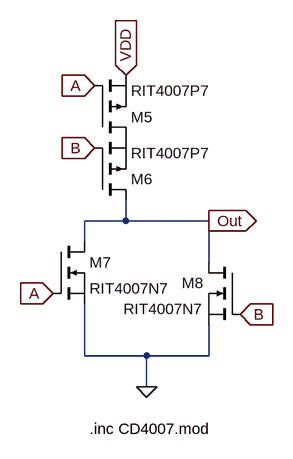
[diagram p0: schematic Gate_NOR.asc]
Gate_NOR.asc, the LTspice schematic file:
Version 4
SHEET 1 880 680
WIRE -656 -80 -656 -112
WIRE -656 -80 -720 -80
WIRE -528 -80 -656 -80
WIRE -720 -48 -720 -80
WIRE -528 -16 -528 -80
WIRE -720 128 -720 48
WIRE -624 128 -720 128
WIRE -528 128 -528 80
WIRE -528 128 -624 128
WIRE -624 176 -624 128
FLAG -656 -304 VDD
IOPIN -656 -304 In
FLAG -528 -80 Out
IOPIN -528 -80 Out
FLAG -704 -288 A
IOPIN -704 -288 In
FLAG -768 32 A
IOPIN -768 32 In
FLAG -480 64 B
IOPIN -480 64 In
FLAG -704 -192 B
IOPIN -704 -192 In
FLAG -624 176 0
SYMBOL pmos -704 -208 M180
SYMATTR InstName M5
SYMATTR Value RIT4007P7
SYMBOL pmos -704 -112 M180
SYMATTR InstName M6
SYMATTR Value RIT4007P7
SYMBOL nmos -768 -48 R0
SYMATTR InstName M7
SYMATTR Value RIT4007N7
SYMBOL nmos -480 -16 M0
SYMATTR InstName M8
SYMATTR Value RIT4007N7
TEXT -712 240 Left 2 !.inc CD4007.mod

The netlist it stands for:
* Gate_NOR.asc
M5 P001 A VDD VDD RIT4007P7
M6 Out B P001 P001 RIT4007P7
M7 Out A 0 0 RIT4007N7
M8 Out B 0 0 RIT4007N7
.model NMOS NMOS
.model PMOS PMOS
.lib standard.mos
.inc CD4007.mod
.backanno
.end